# Altium project BLDC Driver 4.11.PrjPCB
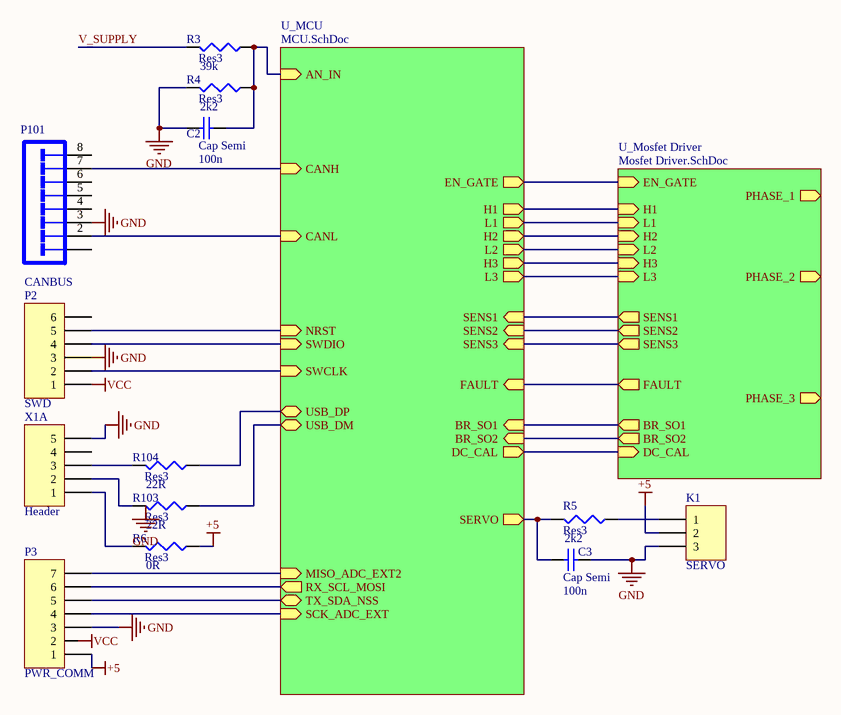
[diagram p0: Connectors.SchDoc]
3 sheets, 88 parts. Net scope: hierarchical (ports join the sheet entries above them; power ports are global).
Sheets:
  Connectors.SchDoc
    U_Mosfet Driver = Mosfet Driver.SchDoc
    U_MCU = MCU.SchDoc

## Sheet Connectors.SchDoc
size A

### Parts
(Parts that share a designator on the sheet are numbered #1, #2 ... from top to bottom, then left to right.)
C2#1  Cap Semi  value 100n  [1608[0603]]
C3  Cap Semi  value 100n  [1608[0603]]
K1  SERVO  [HDR1X3]
P2  SWD  [HDR1X6]
P3  PWR_COMM  [HDR1X7]
P101  CANBUS  [TECO-215877-1_V]
R3  Res3  value 39k  [J1-0603]
R4  Res3  value 2k2  [J1-0603]
R5  Res3  value 2k2  [J1-0603]
R6  Res3  value 0R  [J1-0603]
R103  Res3  value 22R  [J1-0603]
R104  Res3  value 22R  [J1-0603]
X1A  Header  [HDR1X5]

### Sub-sheets
U_MCU = MCU.SchDoc: CANL (in), CANH (in), NRST (in), SENS3 (in), SENS2 (in), SENS1 (in), SCK_ADC_EXT (in), MISO_ADC_EXT2 (in), H3 (out), H2 (out), H1 (out), USB_DM (bidir), USB_DP (bidir), EN_GATE (out), FAULT (in), BR_SO2 (in), BR_SO1 (in), SERVO (out), AN_IN (in), L1 (out), L2 (out), L3 (out), RX_SCL_MOSI (out), SWDIO (in), SWCLK (in), DC_CAL (out), TX_SDA_NSS (bidir)
U_Mosfet Driver = Mosfet Driver.SchDoc: SENS1 (out), SENS2 (out), SENS3 (out), DC_CAL (in), EN_GATE (in), H1 (in), L1 (in), H2 (in), L2 (in), H3 (in), L3 (in), BR_SO2 (out), BR_SO1 (out), FAULT (out), PHASE_2 (out), PHASE_3 (out), PHASE_1 (out)

### Nets
+5: K1.2 P3.1 R6.1
GND: C2#1.2 C3.1 K1.3 P2.3 P3.3 P101.3 R4.2 X1A.5  [project net H1_LOW]
VCC: P2.1
RX_SCL_MOSI: P3.6 ; sheet U_MCU/RX_SCL_MOSI
TX_SDA_NSS: P3.5 ; sheet U_MCU/TX_SDA_NSS
V_SUPPLY: R3.2
NetB3_6: sheet U_Mosfet Driver/FAULT, sheet U_MCU/FAULT
NetB3_12: sheet U_Mosfet Driver/DC_CAL, sheet U_MCU/DC_CAL
NetB3_16: sheet U_Mosfet Driver/EN_GATE, sheet U_MCU/EN_GATE
NetB3_17: sheet U_Mosfet Driver/H1, sheet U_MCU/H1
NetB3_18: sheet U_Mosfet Driver/L1, sheet U_MCU/L1
NetB3_19: sheet U_Mosfet Driver/H2, sheet U_MCU/H2
NetB3_20: sheet U_Mosfet Driver/L2, sheet U_MCU/L2
NetB3_21: sheet U_Mosfet Driver/H3, sheet U_MCU/H3
NetB3_22: sheet U_Mosfet Driver/L3, sheet U_MCU/L3
NetB3_25: sheet U_Mosfet Driver/BR_SO1, sheet U_MCU/BR_SO1
NetB3_26: sheet U_Mosfet Driver/BR_SO2, sheet U_MCU/BR_SO2
NetC2#1_1: C2#1.1 R3.1 R4.1 ; sheet U_MCU/AN_IN
NetC3_2: C3.2 R5.2 ; sheet U_MCU/SERVO
NetC32_2: P2.5 ; sheet U_MCU/NRST
NetK1_1: K1.1 R5.1
NetP2_2: P2.2 ; sheet U_MCU/SWCLK
NetP2_4: P2.4 ; sheet U_MCU/SWDIO
NetP3_4: P3.4 ; sheet U_MCU/SCK_ADC_EXT
NetP3_7: P3.7 ; sheet U_MCU/MISO_ADC_EXT2
NetP101_2: P101.2 ; sheet U_MCU/CANL
NetP101_7: P101.7 ; sheet U_MCU/CANH
NetR6_2: R6.2 X1A.1
NetR23_2: sheet U_Mosfet Driver/SENS1, sheet U_MCU/SENS1
NetR26_2: sheet U_Mosfet Driver/SENS2, sheet U_MCU/SENS2
NetR32_2: sheet U_Mosfet Driver/SENS3, sheet U_MCU/SENS3
NetR103_1: R103.1 ; sheet U_MCU/USB_DM
NetR103_2: R103.2 X1A.2
NetR104_1: R104.1 ; sheet U_MCU/USB_DP
NetR104_2: R104.2 X1A.3

Not connected (* = marked no-connect by the designer): P2 6; P3 2; P101 1 4 5 6 8; X1A 4

### Notes on the sheet
- Labels drawn without touching a wire or pin: GND, VCC

### Library data of the parts
C2#1 C3 = Cap Semi: Capacitor (Semiconductor SIM Model); Published: 8-Jun-2000; LatestRevisionDate: 29-May-2009; LatestRevisionNote: IPC-7351 Footprint Added.; PackageReference: C1206; Publisher: Altium Limited; PackageDescription: Chip Capacitor
K1 = Header 3: Header, 3-Pin; LatestRevisionDate: 17-Jul-2002; LatestRevisionNote: Re-released for DXP Platform.; Publisher: Altium Limited
P2 = Header 6: Header, 6-Pin; LatestRevisionDate: 17-Jul-2002; LatestRevisionNote: Re-released for DXP Platform.; Publisher: Altium Limited
P3 = Header 7: Header, 7-Pin; LatestRevisionDate: 17-Jul-2002; LatestRevisionNote: Re-released for DXP Platform.; Publisher: Altium Limited
P101 = 215877-1: Female Header, Pitch 2.54 mm, 2 x 4 Position, Height 11.5 mm, Tail Length 3 mm, -40 to 105 degC, RoHS, Tape and Reel; Dynamic Catalog: Modular Jacks; Other Names: A105009CT; Number of Ports: 1; Connector Type: Jack; LED Color: Does Not Contain LED; Ratings: Cat3; Number of Positions/Contacts: 8p8c (RJ45, Ethernet); 3D Model: 215877-1.pdf; Tab Direction: Down; Shielding: Unshielded; DatasheetVersion: Rev. AE; PackageReference: THD; Supplier 1: Digi-Key; Supplier Part Number 1: A105009TR-ND; Supplier 2: Digi-Key; Supplier Part Number 2: A105009CT-ND; Features: Board Lock; Packaging: Cut Tape (CT); Termination: Solder; Family: Modular Connectors - Jacks; Contact Finish: Gold; Housing Material: Polybutylene Terephthalate (PBT); RoHS Information: 215877-1 Statement of Compliance; Mounting Type: Through Hole; Contact Material: Phosphor Bronze; Orientation: 90° Angle (Right); Standard Package: 1; Number of Rows: 1; Category: Connectors, Interconnects; ComponentLink1Description: Manufacturer URL; ComponentLink1URL: http://www.te.com; ComponentLink2Description: Datasheet; ComponentLink2URL: https://datasheet.ciiva.com/16310/215877-1-16310656.pdf
R3-R6 R103 R104 = Res3: Resistor; Published: 8-Jun-2000; LatestRevisionDate: 29-May-2009; LatestRevisionNote: IPC-7351 Footprint Added.; PackageReference: J1-0603; Publisher: Altium Limited; PackageDescription: Chip Resistor
X1A = Header 5: Header, 5-Pin; LatestRevisionDate: 17-Jul-2002; LatestRevisionNote: Re-released for DXP Platform.; Publisher: Altium Limited

## Sheet Mosfet Driver.SchDoc
size A
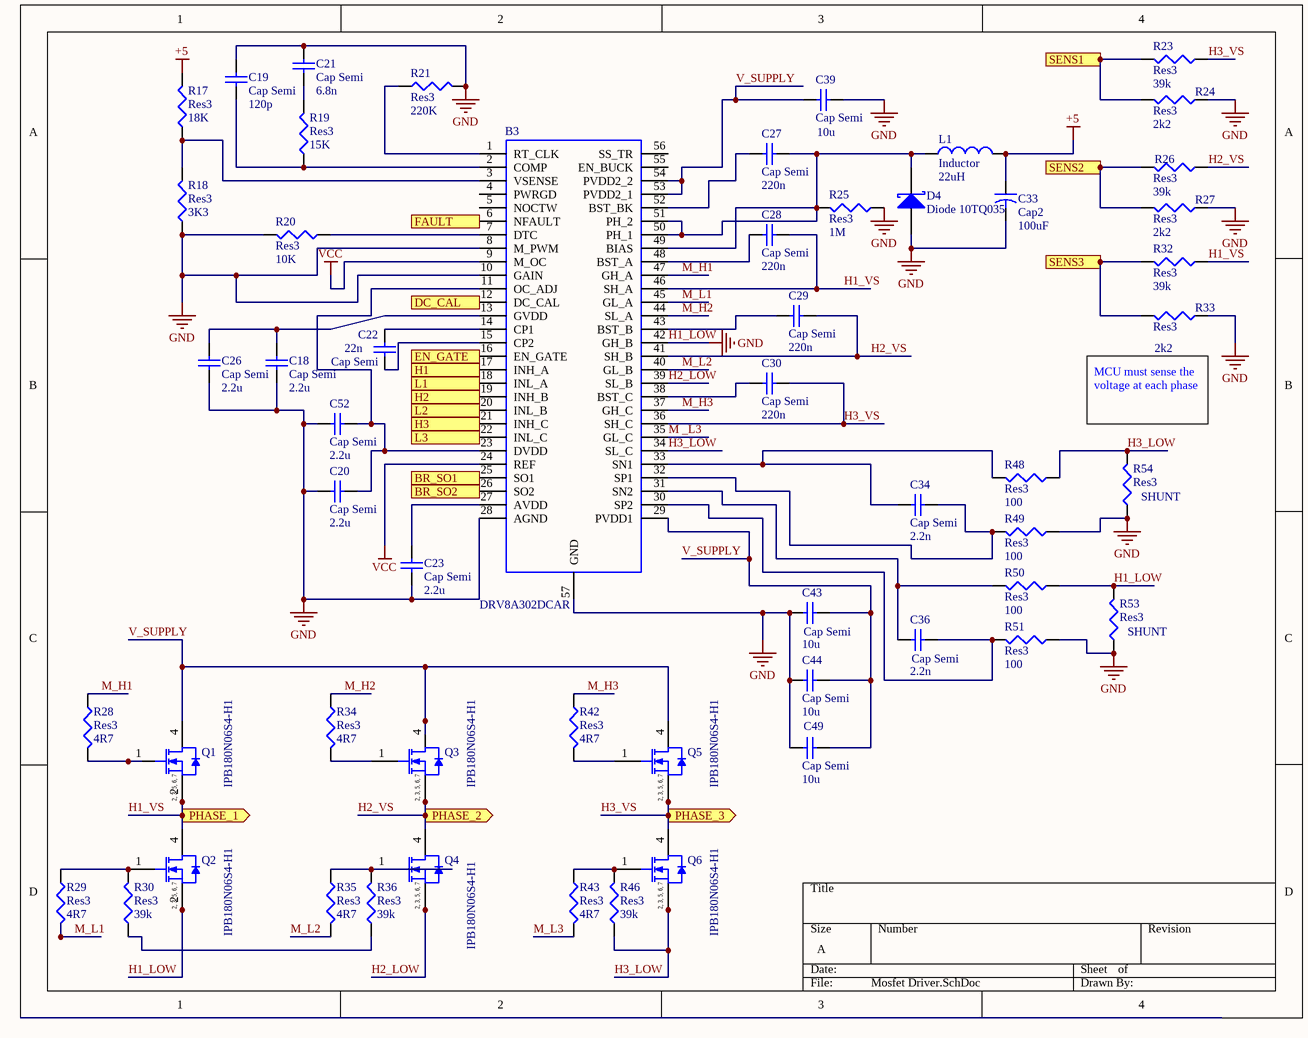
[diagram p1: Mosfet Driver.SchDoc]

### Parts
B3  DRV8A302DCAR  [SOP50P810X120-57N]
C18  Cap Semi  value 2.2u  [1608[0603]]
C19  Cap Semi  value 120p  [1608[0603]]
C20  Cap Semi  value 2.2u  [1608[0603]]
C21  Cap Semi  value 6.8n  [1608[0603]]
C22  Cap Semi  value 22n  [1608[0603]]
C23  Cap Semi  value 2.2u  [1608[0603]]
C26  Cap Semi  value 2.2u  [1608[0603]]
C27  Cap Semi  value 220n  [1608[0603]]
C28  Cap Semi  value 220n  [1608[0603]]
C29  Cap Semi  value 220n  [1608[0603]]
C30  Cap Semi  value 220n  [1608[0603]]
C33  Cap2  value 100uF  [CAPR5-4X5]
C34  Cap Semi  value 2.2n  [1608[0603]]
C36  Cap Semi  value 2.2n  [1608[0603]]
C39  Cap Semi  value 10u  [1608[0603]]
C43  Cap Semi  value 10u  [1608[0603]]
C44  Cap Semi  value 10u  [1608[0603]]
C49  Cap Semi  value 10u  [1608[0603]]
C52  Cap Semi  value 2.2u  [1608[0603]]
D4  Diode 10TQ035  [TO-220AC]
L1  Inductor  value 22uH  [0402-A]
Q1  IPB180N06S4-H1  [INF-PG-TO263-7-3_N]
Q2  IPB180N06S4-H1  [INF-PG-TO263-7-3_N]
Q3  IPB180N06S4-H1  [INF-PG-TO263-7-3_N]
Q4  IPB180N06S4-H1  [INF-PG-TO263-7-3_N]
Q5  IPB180N06S4-H1  [INF-PG-TO263-7-3_N]
Q6  IPB180N06S4-H1  [INF-PG-TO263-7-3_N]
R17  Res3  value 18K  [J1-0603]
R18  Res3  value 3K3  [J1-0603]
R19  Res3  value 15K  [J1-0603]
R20  Res3  value 10K  [J1-0603]
R21  Res3  value 220K  [J1-0603]
R23  Res3  value 39k  [J1-0603]
R24  Res3  value 2k2  [J1-0603]
R25  Res3  value 1M  [J1-0603]
R26  Res3  value 39k  [J1-0603]
R27  Res3  value 2k2  [J1-0603]
R28  Res3  value 4R7  [J1-0603]
R29  Res3  value 4R7  [J1-0603]
R30  Res3  value 39k  [J1-0603]
R32  Res3  value 39k  [J1-0603]
R33  Res3  value 2k2  [J1-0603]
R34  Res3  value 4R7  [J1-0603]
R35  Res3  value 4R7  [J1-0603]
R36  Res3  value 39k  [J1-0603]
R42  Res3  value 4R7  [J1-0603]
R43  Res3  value 4R7  [J1-0603]
R46  Res3  value 39k  [J1-0603]
R48  Res3  value 100  [J1-0603]
R49  Res3  value 100  [J1-0603]
R50  Res3  value 100  [J1-0603]
R51  Res3  value 100  [J1-0603]
R53  Res3  value SHUNT  [J1-0603]
R54  Res3  value SHUNT  [J1-0603]

### Ports
BR_SO1 (out), BR_SO2 (out), DC_CAL (in), EN_GATE (in), FAULT (out), H1 (in), H2 (in), H3 (in), L1 (in), L2 (in), L3 (in), PHASE_1 (out), PHASE_2 (out), PHASE_3 (out), SENS1 (out), SENS2 (out), SENS3 (out)

### Nets
+5: C33.1 L1.2 R17.2
H1_LOW: B3.8(M_PWM) B3.10(GAIN) B3.28(AGND) B3.42(GH_B) B3.57(GND) C18.1 C19.2 C20.2 C21.2 C23.2 C26.1 C33.2 C39.1 C43.2 C44.2 C49.2 C52.2 D4.3(A) Q2.2(SOURCE) Q2.3(SOURCE) Q2.5(SOURCE) Q2.6(SOURCE) Q2.7(SOURCE) R18.1 R20.2 R21.2 R24.1 R25.1 R27.1 R33.1 R49.1 R50.1 R51.1 R53.1 R53.2 R54.1  [also labelled GND]
VCC: B3.9(M_OC) B3.24(REF)
H1_VS: B3.46(SH_A) C28.1 Q1.2(SOURCE) Q1.3(SOURCE) Q1.5(SOURCE) Q1.6(SOURCE) Q1.7(SOURCE) Q2.4(DRAIN) R32.1 ; port PHASE_1
H2_LOW: B3.39(SL_B) Q4.2(SOURCE) Q4.3(SOURCE) Q4.5(SOURCE) Q4.6(SOURCE) Q4.7(SOURCE)
H2_VS: B3.41(SH_B) C29.1 Q3.2(SOURCE) Q3.3(SOURCE) Q3.5(SOURCE) Q3.6(SOURCE) Q3.7(SOURCE) Q4.4(DRAIN) R26.1 ; port PHASE_2
H3_LOW: B3.34(SL_C) Q6.2(SOURCE) Q6.3(SOURCE) Q6.5(SOURCE) Q6.6(SOURCE) Q6.7(SOURCE) R46.1 R48.1 R54.2
H3_VS: B3.36(SH_C) C30.1 Q5.2(SOURCE) Q5.3(SOURCE) Q5.5(SOURCE) Q5.6(SOURCE) Q5.7(SOURCE) Q6.4(DRAIN) R23.1 ; port PHASE_3
M _L3: B3.35(GL_C)
M_H1: B3.47(GH_A) R28.1
M_H2: B3.44(SL_A) R34.1
M_H3: B3.37(GH_C) R42.1
M_L1: B3.45(GL_A) R29.2
M_L2: B3.40(GL_B) R35.2
M_L3: R43.2
V_SUPPLY: B3.29(PVDD1) B3.53(PVDD2_1) B3.54(PVDD2_2) C39.2 C43.1 C44.1 C49.1 Q1.4(DRAIN) Q3.4(DRAIN) Q5.4(DRAIN)
NetB3_1: B3.1(RT_CLK) R21.1
NetB3_2: B3.2(COMP) C19.1 R19.1
NetB3_3: B3.3(VSENSE) R17.1 R18.2
NetB3_6: B3.6(NFAULT) ; port FAULT
NetB3_7: B3.7(DTC) R20.1
NetB3_11: B3.11(OC_ADJ) B3.23(DVDD) C20.1 C52.1
NetB3_12: B3.12(DC_CAL) ; port DC_CAL
NetB3_13: B3.13(GVDD) C18.2 C26.2
NetB3_14: B3.14(CP1) C22.1
NetB3_15: B3.15(CP2) C22.2
NetB3_16: B3.16(EN_GATE) ; port EN_GATE
NetB3_17: B3.17(INH_A) ; port H1
NetB3_18: B3.18(INL_A) ; port L1
NetB3_19: B3.19(INH_B) ; port H2
NetB3_20: B3.20(INL_B) ; port L2
NetB3_21: B3.21(INH_C) ; port H3
NetB3_22: B3.22(INL_C) ; port L3
NetB3_25: B3.25(SO1) ; port BR_SO1
NetB3_26: B3.26(SO2) ; port BR_SO2
NetB3_27: B3.27(AVDD) C23.1
NetB3_30: B3.30(SP2) C36.1 R51.2
NetB3_31: B3.31(SN2) C36.2 R50.2
NetB3_32: B3.32(SP1) C34.1 R49.2
NetB3_33: B3.33(SN1) C34.2 R48.2
NetB3_38: B3.38(BST_C) C30.2
NetB3_43: B3.43(BST_B) C29.2
NetB3_48: B3.48(BST_A) C28.2
NetB3_49: B3.49(BIAS) B3.50(PH_1) B3.51(PH_2) C27.1 D4.1(K) L1.1 R25.2
NetB3_52: B3.52(BST_BK) C27.2
NetC21_1: C21.1 R19.2
NetQ1_1: Q1.1(GATE) R28.2
NetQ2_1: Q2.1(GATE) R29.1 R30.2
NetQ3_1: Q3.1(GATE) R34.2
NetQ4_1: Q4.1(GATE) R35.1 R36.2
NetQ5_1: Q5.1(GATE) R42.2
NetQ6_1: Q6.1(GATE) R43.1 R46.2
NetR23_2: R23.2 R24.2 ; port SENS1
NetR26_2: R26.2 R27.2 ; port SENS2
NetR30_1: R30.1 R36.1
NetR32_2: R32.2 R33.2 ; port SENS3

Not connected (* = marked no-connect by the designer): B3 4(PWRGD) 5(NOCTW) 55(EN_BUCK) 56(SS_TR)

### Notes on the sheet
- MCU must sense the voltage at each phase
- (in symbol IPB180N06S4-H1) 2, 3, 5, 6, 7

### Library data of the parts
B3 = DRV8302DCAR: 3-Phase Brushless Motor Pre-Driver with Dual Current Sense Amps and Buck Converter (PWM Ctrl); Manufacturer_Name: Texas Instruments; Geometry.Height: 1.2mm; Manufacturer_Part_Number: DRV8302DCAR; RS Part Number: *; RS Price/Stock: *; Arrow Part Number: DRV8302DCAR; Arrow Price/Stock: https://www.arrow.com/en/products/drv8302dcar/texas-instruments; Datasheet Link: http://www.ti.com/lit/gpn/drv8302
C18-C23 C26-C30 C34 C36 C39 C43 C44 C49 C52 = Cap Semi: Capacitor (Semiconductor SIM Model); Published: 8-Jun-2000; LatestRevisionDate: 29-May-2009; LatestRevisionNote: IPC-7351 Footprint Added.; PackageReference: C1206; Publisher: Altium Limited; PackageDescription: Chip Capacitor
C33 = Cap2: Capacitor; Published: 23-Sep-2002; PackageReference: CAPR5-4X5; Publisher: Altium Limited; PackageDescription: Capacitor; 2 Leads
D4 = Diode 10TQ035: Schottky Rectifier; Note: Terminal 2 is the TAB and is electrically connected to the cathode; Published: 8-Jun-2000; LatestRevisionDate: 17-Jul-2002; LatestRevisionNote: Re-released for DXP Platform.; DatasheetVersion: PD-2.057B; PackageVersion: Feb-1998; PackageReference: TO-220AC; Publisher: Altium Limited; PackageDescription: TO, Thru-Hole, Vertical, Heatsink Mounted; 3 In-Line Leads (1 Absent); Pitch 2.54 mm; ComponentLink1Description: Manufacturer Link; ComponentLink1URL: http://www.irf.com/; ComponentLink2Description: Datasheet; ComponentLink2URL: http://www.irf.com/product-info/datasheets/data/10tq.pdf
L1 = Inductor: Code_IEC: 1005; Published: 8-Jun-2000; LatestRevisionDate: 29-May-2009; LatestRevisionNote: IPC-7351 Footprint Added.; PackageReference: 0402-A; Publisher: Altium Limited; PackageDescription: Chip Inductor; Code_JEITA: 0402
Q1-Q6 = IPB180N06S4-H1: OptiMOS-T2 Power-Transistor, 60 V VDS, 180 A ID, PG-TO263-7-3, Reel, Green; Manufacturer: Infineon; Green: TRUE; ID (max): 180 A; IDpuls (max): 720 A; Ptot (max): 250 W; QG: 208 nC; RDS (on) (max) (@10V): 1.7 mOhm; RthJC (max): 0.6 K/W; VDS (max): 60 V; VGS(th) (max): 4 V; VGS(th) (min): 2 V; DatasheetVersion: Rev. 1.0; PackageReference: PG-TO263-7-3; PackageDescription: 7-Pin Plastic (Green) Transistor Single Outline Package, 10 x 9.25 mm Body, 1.27 mm Pitch; Supplier 1: Mouser; Supplier Part Number 1: 726-IPB180N06S4-H1; Supplier 2: Digi-Key; Supplier Part Number 2: IPB180N06S4-H1-ND; Halogen-free: TRUE; Packing: Reel; Technology: OptiMOS-T2; Mounting Technology: Surface Mount; PartNumber: IPB180N06S4-H1; ComponentLink1Description: Manufacturer URL; ComponentLink1URL: http://www.infineon.com/; ComponentLink2Description: Datasheet; ComponentLink2URL: http://www.infineon.com/dgdl/IPB180N06S4-H1_DS_10.pdf?folderId=db3a30431ff9881501203cca7672178b&fileId=db3a30431ff9881501203ccc9314178e&location=en.Products.Automotive_ICs.Automotive_MOSFETs.Single__N-Channel_60V_MOSFETs.DATASHEET.IPB180N06S4-H1_DS_10.pdf; ComponentLink3Description: Package Specification; ComponentLink3URL: http://www.infineon.com/cms/packages/SMD_-_Surface_Mounted_Devices/P-PG-TO263/P-TO263-07-02x_-3.html?__locale=en
R17-R21 R23-R30 R32-R36 R42 R43 R46 R48-R51 R53 R54 = Res3: Resistor; Published: 8-Jun-2000; LatestRevisionDate: 29-May-2009; LatestRevisionNote: IPC-7351 Footprint Added.; PackageReference: J1-0603; Publisher: Altium Limited; PackageDescription: Chip Resistor

## Sheet MCU.SchDoc
size A
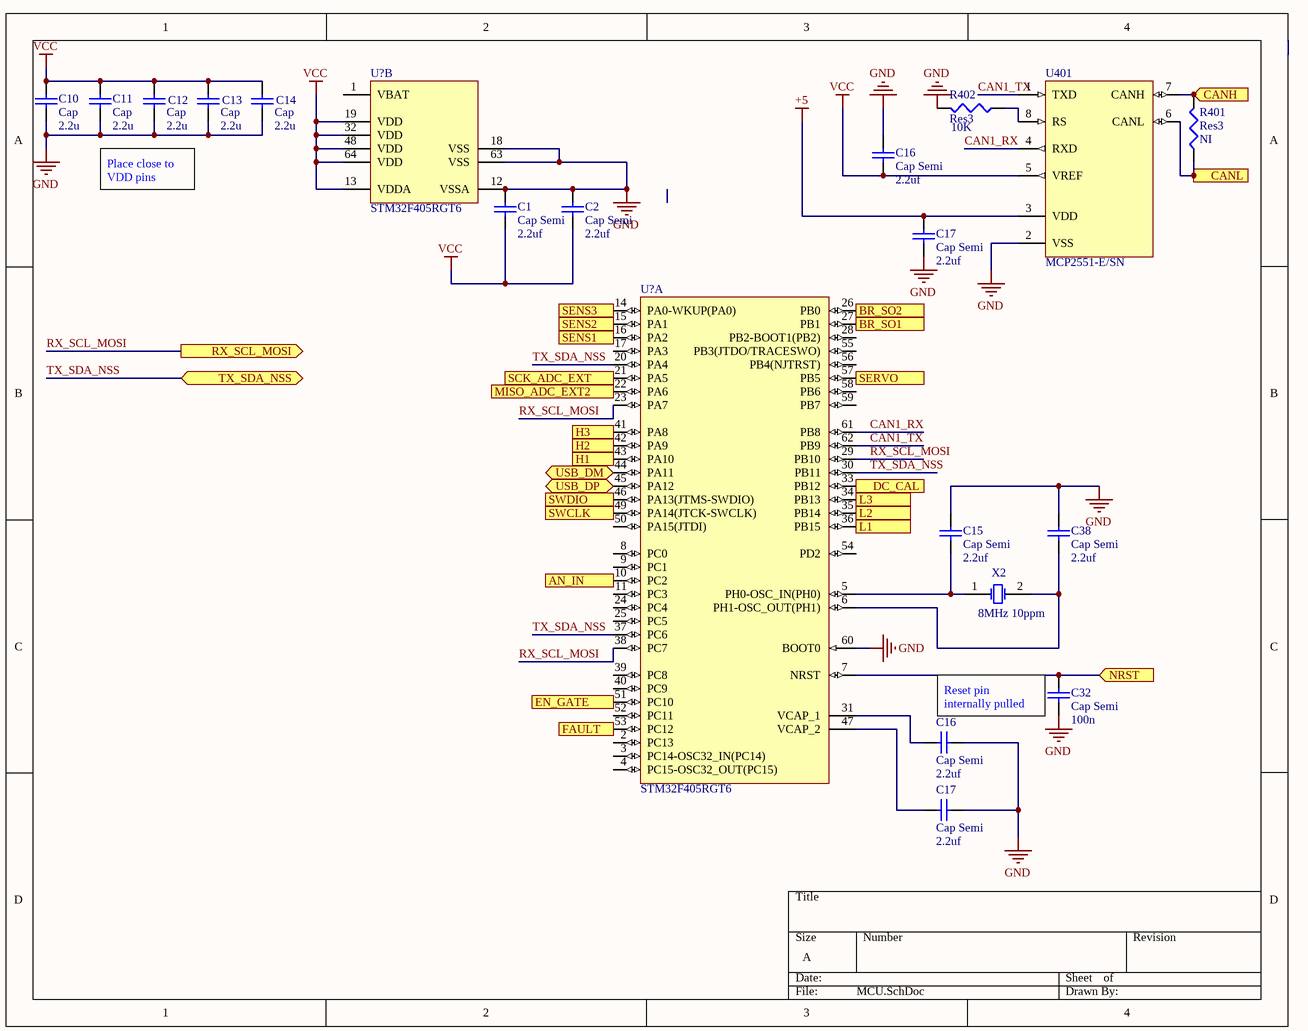
[diagram p2: MCU.SchDoc]

### Parts
(Parts that share a designator on the sheet are numbered #1, #2 ... from top to bottom, then left to right.)
C1  Cap Semi  value 2.2uf  [1608[0603]]
C2#2  Cap Semi  value 2.2uf  [1608[0603]]
C10  Cap  value 2.2u  [RAD-0.3]
C11  Cap  value 2.2u  [RAD-0.3]
C12  Cap  value 2.2u  [RAD-0.3]
C13  Cap  value 2.2u  [RAD-0.3]
C14  Cap  value 2.2u  [RAD-0.3]
C15  Cap Semi  value 2.2uf  [1608[0603]]
C16#1  Cap Semi  value 2.2uf  [1608[0603]]
C16#2  Cap Semi  value 2.2uf  [1608[0603]]
C17#1  Cap Semi  value 2.2uf  [1608[0603]]
C17#2  Cap Semi  value 2.2uf  [1608[0603]]
C32  Cap Semi  value 100n  [1608[0603]]
C38  Cap Semi  value 2.2uf  [1608[0603]]
R401  Res3  value NI  [J1-0603]
R402  Res3  value 10K  [J1-0603]
U401  MCP2551-E/SN  [SOIC-SN8_N]
U?#1  STM32F405RGT6  [STM-LQFP64_N]  (part B of 2)
U?#2  STM32F405RGT6  [STM-LQFP64_N]  (part A of 2)
X2  8MHz 10ppm  [R38]

### Ports
AN_IN (in), BR_SO1 (in), BR_SO2 (in), CANH (in), CANL (in), DC_CAL (out), EN_GATE (out), FAULT (in), H1 (out), H2 (out), H3 (out), L1 (out), L2 (out), L3 (out), MISO_ADC_EXT2 (in), NRST (in), RX_SCL_MOSI (out), SCK_ADC_EXT (in), SENS1 (in), SENS2 (in), SENS3 (in), SERVO (out), SWCLK (in), SWDIO (in), TX_SDA_NSS (bidir), USB_DM (bidir), USB_DP (bidir)

### Nets
+5: C17#1.2 U401.3(VDD)
GND: C1.2 C2#2.2 C10.1 C11.1 C12.1 C13.1 C14.1 C15.2 C16#1.2 C16#2.1 C17#1.1 C17#2.1 C32.1 C38.2 R402.2 U401.2(VSS) U?#1.12(VSSA) U?#1.18(VSS) U?#1.63(VSS) U?#2.60(BOOT0)  [project net H1_LOW]
VCC: C1.1 C2#2.1 C10.2 C11.2 C12.2 C13.2 C14.2 C16#1.1 U401.5(VREF) U?#1.13(VDDA) U?#1.19(VDD) U?#1.32(VDD) U?#1.48(VDD) U?#1.64(VDD)
CAN1_RX: U401.4(RXD) U?#2.61(PB8)
CAN1_TX: U401.1(TXD) U?#2.62(PB9)
RX_SCL_MOSI: U?#2.23(PA7) U?#2.29(PB10) U?#2.38(PC7) ; port RX_SCL_MOSI
TX_SDA_NSS: U?#2.20(PA4) U?#2.30(PB11) U?#2.37(PC6) ; port TX_SDA_NSS
NetB3_6: U?#2.53(PC12) ; port FAULT
NetB3_12: U?#2.33(PB12) ; port DC_CAL
NetB3_16: U?#2.51(PC10) ; port EN_GATE
NetB3_17: U?#2.43(PA10) ; port H1
NetB3_18: U?#2.36(PB15) ; port L1
NetB3_19: U?#2.42(PA9) ; port H2
NetB3_20: U?#2.35(PB14) ; port L2
NetB3_21: U?#2.41(PA8) ; port H3
NetB3_22: U?#2.34(PB13) ; port L3
NetB3_25: U?#2.27(PB1) ; port BR_SO1
NetB3_26: U?#2.26(PB0) ; port BR_SO2
NetC2#1_1: U?#2.10(PC2) ; port AN_IN
NetC3_2: U?#2.57(PB5) ; port SERVO
NetC15_1: C15.1 U?#2.5(PH0-OSC_IN(PH0)) X2.1(OSC1)
NetC16#2_2: C16#2.2 U?#2.31(VCAP_1)
NetC17#2_2: C17#2.2 U?#2.47(VCAP_2)
NetC32_2: C32.2 U?#2.7(NRST) ; port NRST
NetC38_1: C38.1 U?#2.6(PH1-OSC_OUT(PH1)) X2.2(OSC2)
NetP2_2: U?#2.49(PA14(JTCK-SWCLK)) ; port SWCLK
NetP2_4: U?#2.46(PA13(JTMS-SWDIO)) ; port SWDIO
NetP3_4: U?#2.21(PA5) ; port SCK_ADC_EXT
NetP3_7: U?#2.22(PA6) ; port MISO_ADC_EXT2
NetP101_2: R401.1 U401.6(CANL) ; port CANL
NetP101_7: R401.2 U401.7(CANH) ; port CANH
NetR23_2: U?#2.16(PA2) ; port SENS1
NetR26_2: U?#2.15(PA1) ; port SENS2
NetR32_2: U?#2.14(PA0-WKUP(PA0)) ; port SENS3
NetR103_1: U?#2.44(PA11) ; port USB_DM
NetR104_1: U?#2.45(PA12) ; port USB_DP
NetR402_1: R402.1 U401.8(RS)

Not connected (* = marked no-connect by the designer): U?#1 1(VBAT); U?#2 2(PC13) 3(PC14-OSC32_IN(PC14)) 4(PC15-OSC32_OUT(PC15)) 8(PC0) 9(PC1) 11(PC3) 17(PA3) 24(PC4) 25(PC5) 28(PB2-BOOT1(PB2)) 39(PC8) 40(PC9) 50(PA15(JTDI)) 52(PC11) 54(PD2) 55(PB3(JTDO/TRACESWO)) 56(PB4(NJTRST)) 58(PB6) 59(PB7)

### Notes on the sheet
- Place close to VDD pins
- (near C32) Reset pin internally pulled up

### Library data of the parts
C1 C2#2 C15 C16#1 C16#2 C17#1 C17#2 C32 C38 = Cap Semi: Capacitor (Semiconductor SIM Model); Published: 8-Jun-2000; LatestRevisionDate: 29-May-2009; LatestRevisionNote: IPC-7351 Footprint Added.; PackageReference: C1206; Publisher: Altium Limited; PackageDescription: Chip Capacitor
C10-C14 = Cap: Capacitor; Published: 8-Jun-2000; LatestRevisionDate: 17-Jul-2002; LatestRevisionNote: Re-released for DXP Platform.; PackageReference: RAD-0.3; Publisher: Altium Limited; PackageDescription: Radial Cap, Thru-Hole; 2 Leads; 0.3 in Pin Spacing
R401 R402 = Res3: Resistor; Published: 8-Jun-2000; LatestRevisionDate: 29-May-2009; LatestRevisionNote: IPC-7351 Footprint Added.; PackageReference: J1-0603; Publisher: Altium Limited; PackageDescription: Chip Resistor
U401 = MCP2551-E/SN: High-Speed CAN Transceiver, 8-Pin SOIC, Extended Temperature; Manufacturer: Microchip; DatasheetVersion: revF, Jul-2010; PackageVersion: revBB, Aug-2009; PackageReference: SOIC-SN8; PackageDescription: 8-Lead Plastic Small Outline (SN) - Narrow, 3.90mm Body [SOIC]; Supplier 1: Digi-Key; Supplier Part Number 1: MCP2551-E/SN-ND; Supplier 2: Farnell; Supplier Part Number 2: 1467746; Supplier 3: Newark; Supplier Part Number 3: 92C4186; Supplier 4: Mouser; Supplier Part Number 4: 579-MCP2551-E/SN; Mounting Technology: Surface Mount; Code_JEDEC: MS-012; Code_IPC: SOIC127P600-8; PartNumber: MCP2551-E/SN; ComponentLink1Description: Manufacturer URL; ComponentLink1URL: http://www.microchip.com/; ComponentLink2Description: Datasheet; ComponentLink2URL: http://ww1.microchip.com/downloads/en/DeviceDoc/21667F.pdf; ComponentLink3Description: Package Specification; ComponentLink3URL: http://www.microchip.com/stellent/groups/techpub_sg/documents/packagingspec/en012702.pdf
U?#1 U?#2 = STM32F405RGT6: ARM Cortex-M4 32-bit MCU+FPU, 210 DMIPS, 1024 kB Flash, 192 kB Internal RAM, 51 I/Os, 64-pin LQFP, -40 to 85 degC, Tray; Manufacturer: STMicroelectronics; D/A Converter: 2x12-bit; FLASH Size (Prog) (kB): 1024; I/Os (High Current): 51; Internal RAM Size (kB): 192; Operating Frequency(F) (Processor speed) (MHz): 168; Supply Voltage(Vcc) max (V): 3.6; Supply Voltage(Vcc) min (V): 1.8; DatasheetVersion: Rev. 4; PackageVersion: Rev. 4, 06/2013; PackageReference: LQFP64; PackageDescription: 64-Pin Low Profile Quad Flat Package, 10 x 10 mm Body, 0.5 mm Pitch; Supplier 1: Digi-Key; Supplier Part Number 1: 497-11767-ND; Supplier 2: Farnell; Supplier Part Number 2: 2064363; Supplier 3: Newark; Supplier Part Number 3: 73T2329; Supplier 4: Mouser; Supplier Part Number 4: 511-STM32F405RGT6; Core: ARM Cortex-M4; Packing: Tray; Mounting Technology: Surface Mount; PartNumber: STM32F405RGT6; ComponentLink1Description: Manufacturer URL; ComponentLink1URL: http://www.st.com/web/en/home.html; ComponentLink2Description: Datasheet; ComponentLink2URL: http://www.st.com/st-web-ui/static/active/en/resource/technical/document/datasheet/DM00037051.pdf; ComponentLink3Description: Package Specification; ComponentLink3URL: http://www.st.com/st-web-ui/static/active/en/resource/technical/document/datasheet/DM00037051.pdf
X2 = XTAL: Crystal Oscillator; Published: 8-Jun-2000; LatestRevisionDate: 17-Jul-2002; LatestRevisionNote: Re-released for DXP Platform.; PackageReference: R38; Publisher: Altium Limited; PackageDescription: Crystal, Thru-Hole; 2 Leads; Body 3.1 x 8.2 mm (Dia.xH)

## Nets that join several sheets
+5: Connectors (K1.2 P3.1 R6.1), Mosfet Driver (C33.1 L1.2 R17.2), MCU (C17#1.2 U401.3)
H1_LOW: Connectors (8 pins), Mosfet Driver (36 pins), MCU (20 pins)
VCC: Connectors (P2.1), Mosfet Driver (B3.9 B3.24), MCU (14 pins)
NetB3_6: Mosfet Driver (B3.6), MCU (U?#2.53)
NetB3_12: Mosfet Driver (B3.12), MCU (U?#2.33)
NetB3_16: Mosfet Driver (B3.16), MCU (U?#2.51)
NetB3_17: Mosfet Driver (B3.17), MCU (U?#2.43)
NetB3_18: Mosfet Driver (B3.18), MCU (U?#2.36)
NetB3_19: Mosfet Driver (B3.19), MCU (U?#2.42)
NetB3_20: Mosfet Driver (B3.20), MCU (U?#2.35)
NetB3_21: Mosfet Driver (B3.21), MCU (U?#2.41)
NetB3_22: Mosfet Driver (B3.22), MCU (U?#2.34)
NetB3_25: Mosfet Driver (B3.25), MCU (U?#2.27)
NetB3_26: Mosfet Driver (B3.26), MCU (U?#2.26)
NetC2#1_1: Connectors (C2#1.1 R3.1 R4.1), MCU (U?#2.10)
NetC3_2: Connectors (C3.2 R5.2), MCU (U?#2.57)
NetC32_2: Connectors (P2.5), MCU (C32.2 U?#2.7)
NetP2_2: Connectors (P2.2), MCU (U?#2.49)
NetP2_4: Connectors (P2.4), MCU (U?#2.46)
NetP3_4: Connectors (P3.4), MCU (U?#2.21)
NetP3_7: Connectors (P3.7), MCU (U?#2.22)
NetP101_2: Connectors (P101.2), MCU (R401.1 U401.6)
NetP101_7: Connectors (P101.7), MCU (R401.2 U401.7)
NetR23_2: Mosfet Driver (R23.2 R24.2), MCU (U?#2.16)
NetR26_2: Mosfet Driver (R26.2 R27.2), MCU (U?#2.15)
NetR32_2: Mosfet Driver (R32.2 R33.2), MCU (U?#2.14)
NetR103_1: Connectors (R103.1), MCU (U?#2.44)
NetR104_1: Connectors (R104.1), MCU (U?#2.45)
RX_SCL_MOSI: Connectors (P3.6), MCU (U?#2.23 U?#2.29 U?#2.38)
TX_SDA_NSS: Connectors (P3.5), MCU (U?#2.20 U?#2.30 U?#2.37)